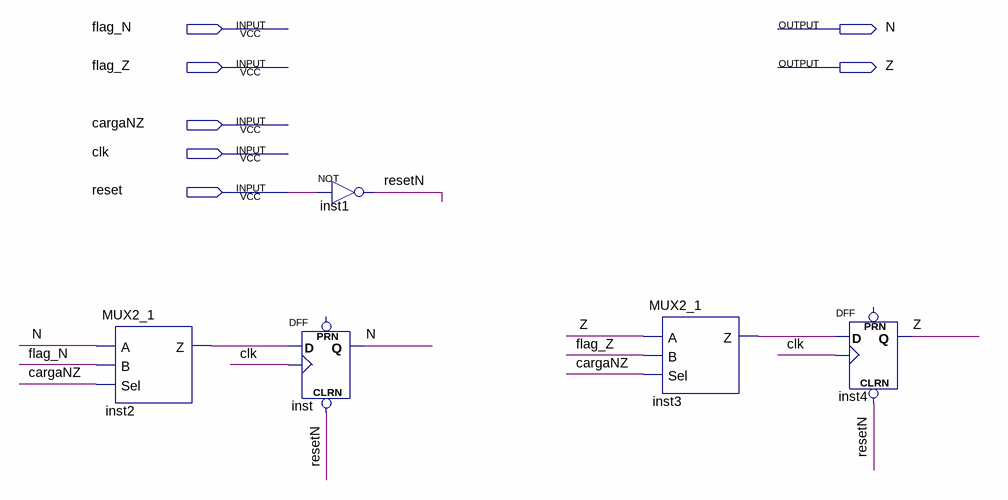
[diagram p0: schematic sheet]
// Quartus schematic regNZ.bdf as structural Verilog: 5 symbols, 7 pins
module regNZ (
  input  flag_N,
  input  flag_Z,
  input  cargaNZ,
  input  clk,
  input  reset,
  output N,
  output Z
);

  wire inst2_z, inst3_z, resetN;

  MUX2_1 inst2 (.A(N), .B(flag_N), .Sel(cargaNZ), .Z(inst2_z));
  not inst1 (resetN, reset);
  DFF inst (.CLRN(resetN), .CLK(clk), .D(inst2_z), .Q(N));  // open: PRN
  MUX2_1 inst3 (.A(Z), .B(flag_Z), .Sel(cargaNZ), .Z(inst3_z));
  DFF inst4 (.CLRN(resetN), .CLK(clk), .D(inst3_z), .Q(Z));  // open: PRN
endmodule
